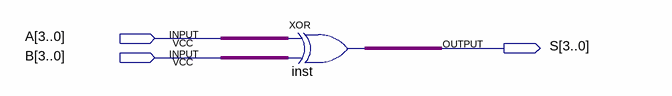
[diagram p0: schematic sheet]
// Quartus schematic XOR4BIT.bdf as structural Verilog: 1 symbols, 3 pins
module XOR4BIT (
  input  [3:0] A,
  input  [3:0] B,
  output [3:0] S
);

  assign S = A ^ B;  // XOR inst, 4 bits wide
endmodule
